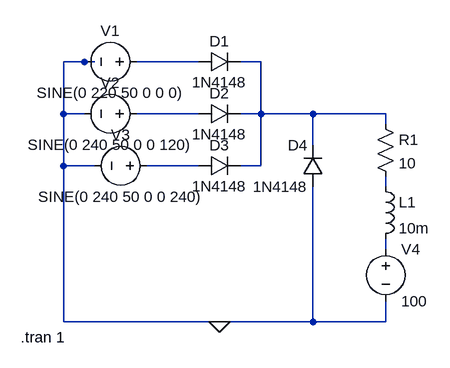
[diagram p0: schematic 3phase_half_wave_rectifier_usingRLE(FD).asc]
3phase_half_wave_rectifier_usingRLE(FD).asc, the LTspice schematic file:
Version 4
SHEET 1 880 680
WIRE -32 112 -64 112
WIRE -16 112 -32 112
WIRE 144 112 48 112
WIRE 240 112 208 112
WIRE -64 192 -64 112
WIRE -32 192 -64 192
WIRE 144 192 48 192
WIRE 240 192 240 112
WIRE 240 192 208 192
WIRE 320 192 240 192
WIRE 432 192 320 192
WIRE 432 208 432 192
WIRE 320 240 320 192
WIRE -64 272 -64 192
WIRE -16 272 -64 272
WIRE 144 272 64 272
WIRE 240 272 240 192
WIRE 240 272 208 272
WIRE 432 304 432 288
WIRE 432 400 432 384
WIRE -64 512 -64 272
WIRE 176 512 -64 512
WIRE 320 512 320 304
WIRE 320 512 176 512
WIRE 432 512 432 480
WIRE 432 512 320 512
FLAG 176 512 0
SYMBOL diode 144 128 R270
WINDOW 0 32 32 VTop 2
WINDOW 3 0 32 VBottom 2
SYMATTR InstName D1
SYMATTR Value 1N4148
SYMBOL diode 144 208 R270
WINDOW 0 32 32 VTop 2
WINDOW 3 0 32 VBottom 2
SYMATTR InstName D2
SYMATTR Value 1N4148
SYMBOL diode 144 288 R270
WINDOW 0 32 32 VTop 2
WINDOW 3 0 32 VBottom 2
SYMATTR InstName D3
SYMATTR Value 1N4148
SYMBOL voltage 64 112 R90
WINDOW 0 -32 56 VBottom 2
WINDOW 3 32 56 VTop 2
WINDOW 123 0 0 Left 0
WINDOW 39 0 0 Left 0
SYMATTR InstName V1
SYMATTR Value SINE(0 220 50 0 0 0)
SYMBOL voltage 64 192 R90
WINDOW 0 -32 56 VBottom 2
WINDOW 3 32 56 VTop 2
WINDOW 123 0 0 Left 0
WINDOW 39 0 0 Left 0
SYMATTR InstName V2
SYMATTR Value SINE(0 240 50 0 0 120)
SYMBOL voltage 80 272 R90
WINDOW 0 -32 56 VBottom 2
WINDOW 3 32 56 VTop 2
WINDOW 123 0 0 Left 0
WINDOW 39 0 0 Left 0
SYMATTR InstName V3
SYMATTR Value SINE(0 240 50 0 0 240)
SYMBOL res 416 192 R0
SYMATTR InstName R1
SYMATTR Value 10
SYMBOL ind 416 288 R0
SYMATTR InstName L1
SYMATTR Value 10m
SYMBOL diode 336 304 R180
WINDOW 0 24 64 Left 2
WINDOW 3 24 0 Left 2
SYMATTR InstName D4
SYMATTR Value 1N4148
SYMBOL voltage 432 384 R0
WINDOW 123 0 0 Left 0
WINDOW 39 0 0 Left 0
SYMATTR InstName V4
SYMATTR Value 100
TEXT -130 536 Left 2 !.tran 1

The netlist it stands for:
* 3phase_half_wave_rectifier_usingRLE(FD).asc
D1 N001 N002 1N4148
D2 N003 N002 1N4148
D3 N004 N002 1N4148
V1 N001 0 SINE(0 220 50 0 0 0)
V2 N003 0 SINE(0 240 50 0 0 120)
V3 N004 0 SINE(0 240 50 0 0 240)
R1 N002 N005 10
L1 N005 N006 10m
D4 0 N002 1N4148
V4 N006 0 100
.model D D
.lib standard.dio
.tran 1
.backanno
.end